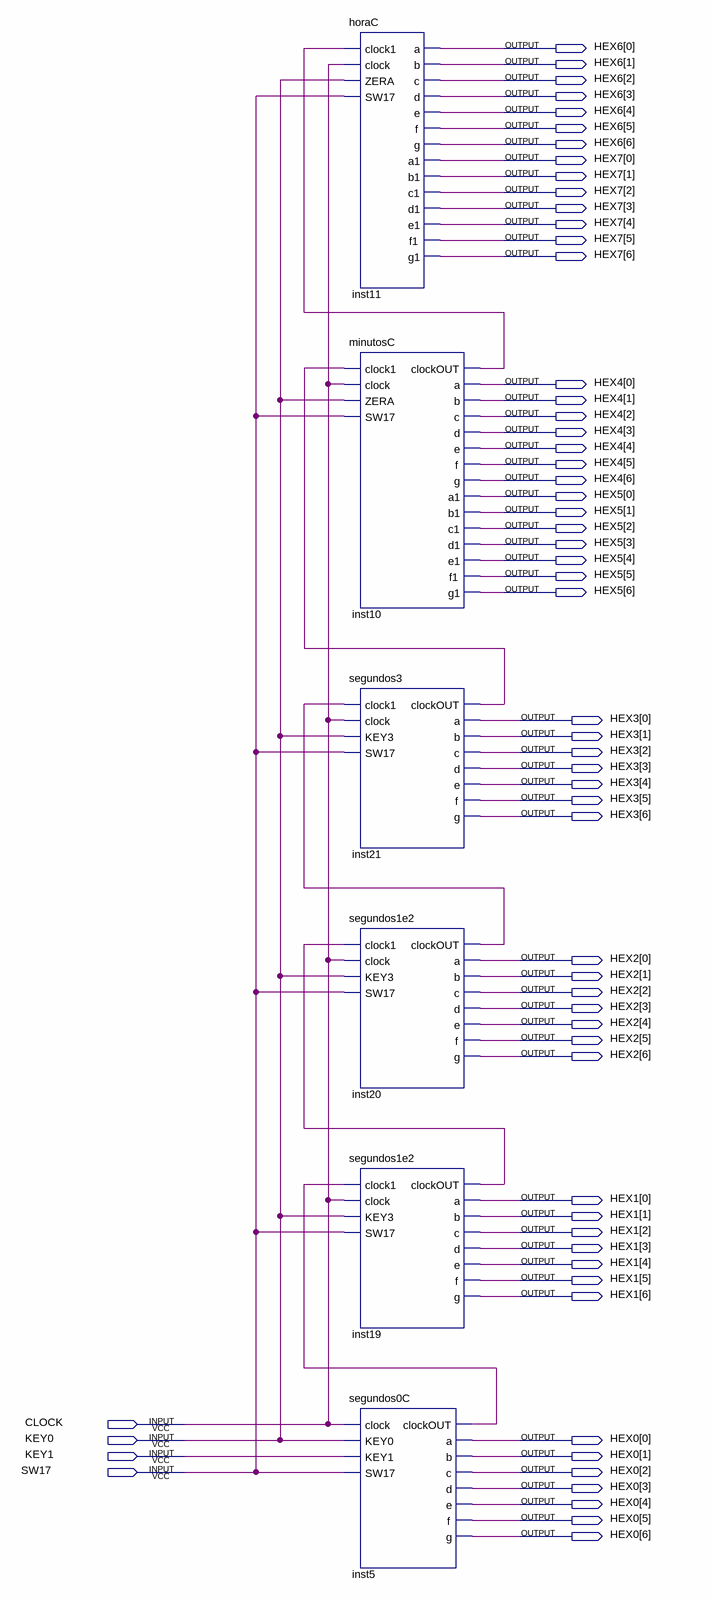
[diagram p0: schematic sheet]
// Quartus schematic CRONOMETRO.bdf as structural Verilog: 6 symbols, 60 pins
module CRONOMETRO (
  input  CLOCK,
  input  KEY0,
  input  KEY1,
  input  SW17,
  output [6:0] HEX6,
  output [6:0] HEX7,
  output [6:0] HEX4,
  output [6:0] HEX5,
  output [6:0] HEX3,
  output [6:0] HEX2,
  output [6:0] HEX1,
  output [6:0] HEX0
);

  wire inst5_clockout, inst10_clockout, inst19_clockout, inst20_clockout, inst21_clockout;

  horaC inst11 (
    .clock1(inst10_clockout), .clock(CLOCK), .ZERA(KEY0), .SW17(SW17), .a(HEX6[0]), .b(HEX6[1]), .c(HEX6[2]),
    .d(HEX6[3]), .e(HEX6[4]), .f(HEX6[5]), .g(HEX6[6]), .a1(HEX7[0]), .b1(HEX7[1]), .c1(HEX7[2]),
    .d1(HEX7[3]), .e1(HEX7[4]), .f1(HEX7[5]), .g1(HEX7[6]));
  minutosC inst10 (
    .clock1(inst21_clockout), .clock(CLOCK), .ZERA(KEY0), .SW17(SW17), .clockOUT(inst10_clockout),
    .a(HEX4[0]), .b(HEX4[1]), .c(HEX4[2]), .d(HEX4[3]), .e(HEX4[4]), .f(HEX4[5]), .g(HEX4[6]), .a1(HEX5[0]),
    .b1(HEX5[1]), .c1(HEX5[2]), .d1(HEX5[3]), .e1(HEX5[4]), .f1(HEX5[5]), .g1(HEX5[6]));
  segundos3 inst21 (
    .clock1(inst20_clockout), .clock(CLOCK), .KEY3(KEY0), .SW17(SW17), .clockOUT(inst21_clockout),
    .a(HEX3[0]), .b(HEX3[1]), .c(HEX3[2]), .d(HEX3[3]), .e(HEX3[4]), .f(HEX3[5]), .g(HEX3[6]));
  segundos1e2 inst20 (
    .clock1(inst19_clockout), .clock(CLOCK), .KEY3(KEY0), .SW17(SW17), .clockOUT(inst20_clockout),
    .a(HEX2[0]), .b(HEX2[1]), .c(HEX2[2]), .d(HEX2[3]), .e(HEX2[4]), .f(HEX2[5]), .g(HEX2[6]));
  segundos1e2 inst19 (
    .clock1(inst5_clockout), .clock(CLOCK), .KEY3(KEY0), .SW17(SW17), .clockOUT(inst19_clockout),
    .a(HEX1[0]), .b(HEX1[1]), .c(HEX1[2]), .d(HEX1[3]), .e(HEX1[4]), .f(HEX1[5]), .g(HEX1[6]));
  segundos0C inst5 (
    .clock(CLOCK), .KEY0(KEY0), .KEY1(KEY1), .SW17(SW17), .clockOUT(inst5_clockout), .a(HEX0[0]),
    .b(HEX0[1]), .c(HEX0[2]), .d(HEX0[3]), .e(HEX0[4]), .f(HEX0[5]), .g(HEX0[6]));
endmodule
